# EAGLE design MegaPlay (EAGLE 7.2.0)
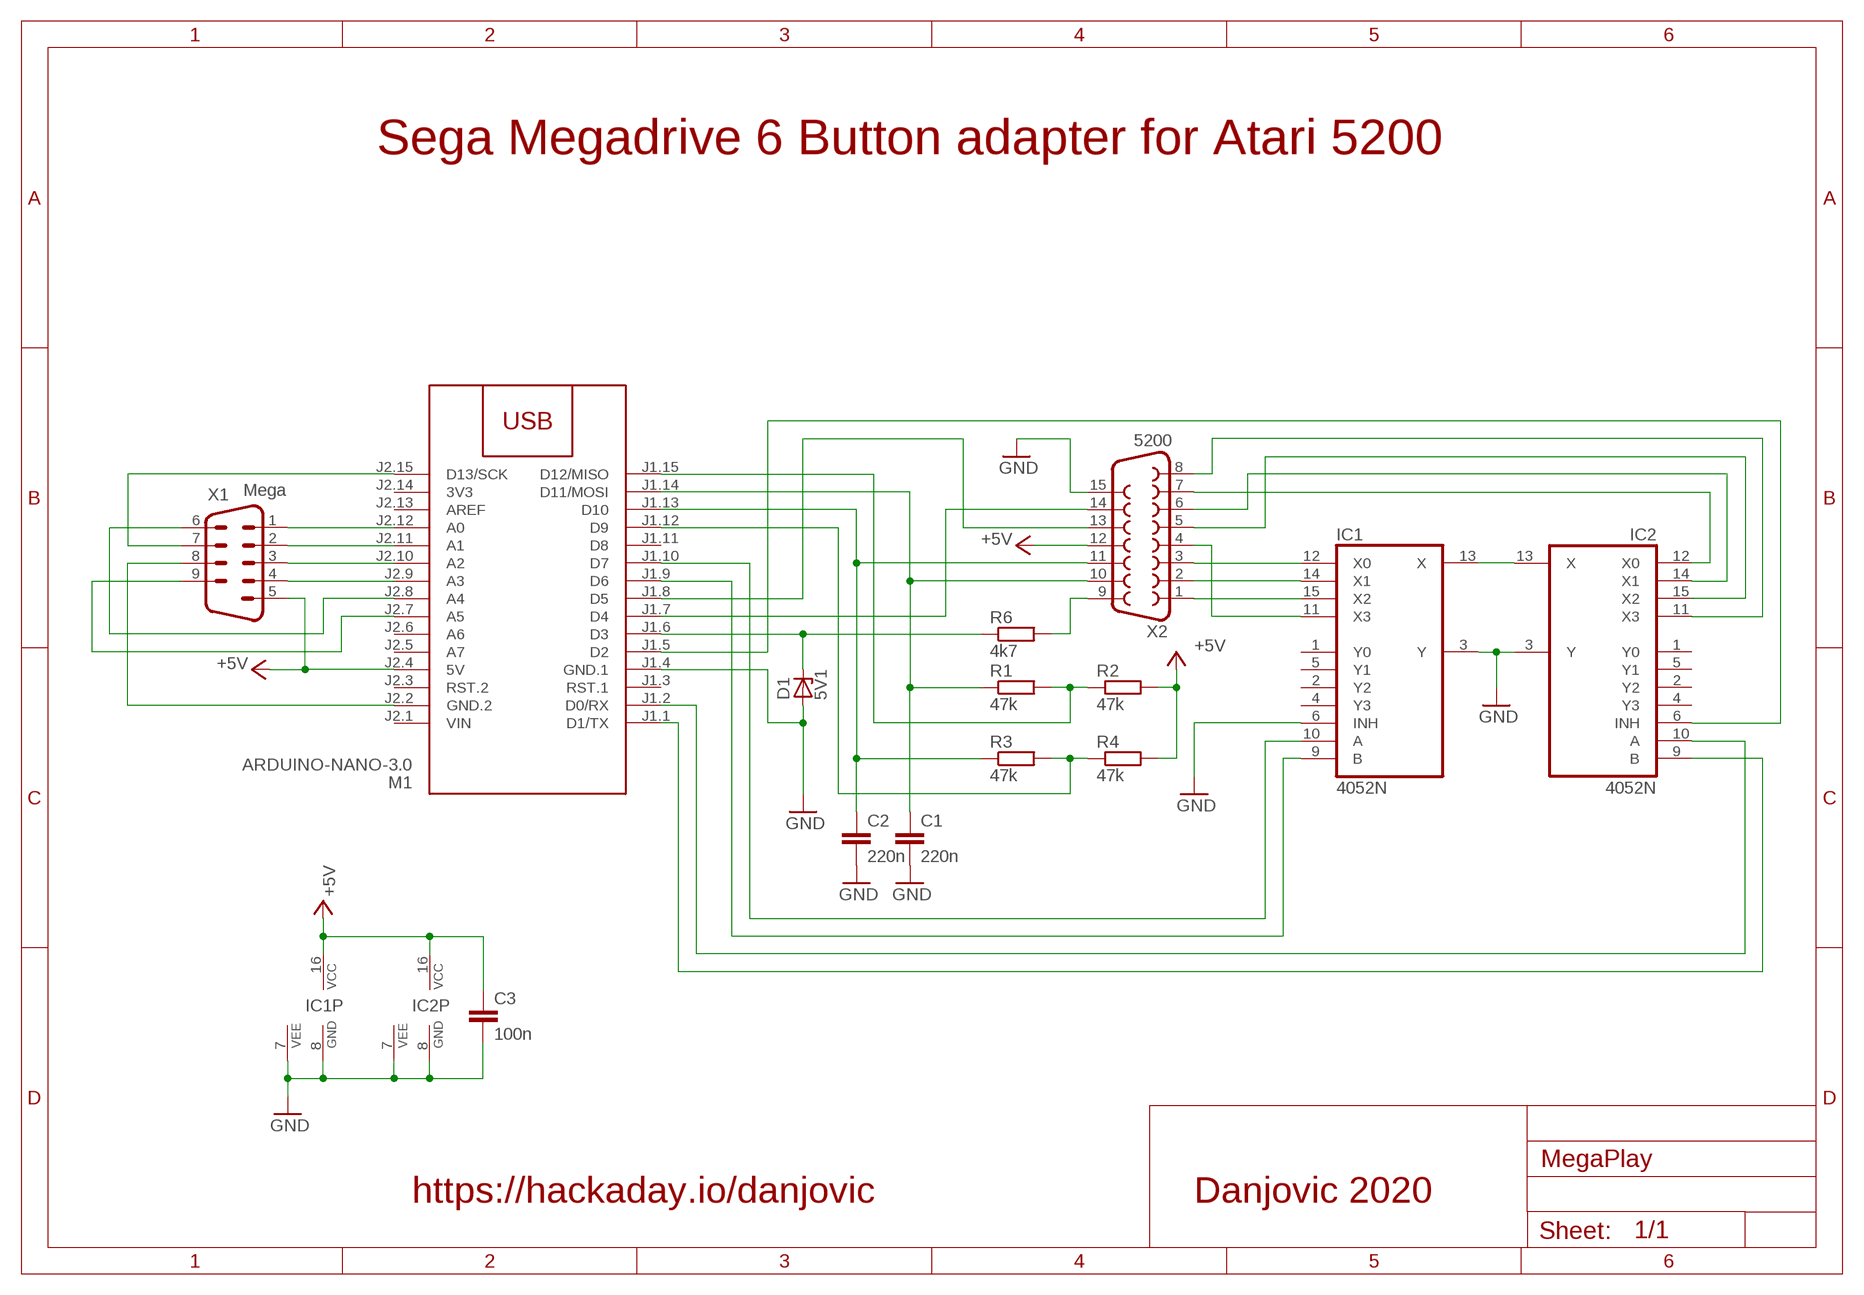
[diagram p0: schematic, sheet 1]

## Parts
C1  220n  C-EU050-025X075  [C050-025X075]
C2  220n  C-EU050-025X075  [C050-025X075]
C3  100n  C-EU050-024X044  [C050-024X044]
D1  5V1  ZENER-DIODEZD-7.5  [ZDIO-7.5]
IC1  4052N  [DIL16]
IC2  4052N  [DIL16]
M1  ARDUINO-NANO-3.0  [ARDUINO-NANO-3.0]
R1  47k  R-EU_0204/7  [0204/7]
R2  47k  R-EU_0204/7  [0204/7]
R3  47k  R-EU_0204/7  [0204/7]
R4  47k  R-EU_0204/7  [0204/7]
R6  4k7  R-EU_0204/7  [0204/7]
X1  Mega  M09D  [M09D]
X2  5200  F15D  [F15D]

## Nets
+5V: C3.1 IC1.16(VCC) IC2.16(VCC) M1.J2.4(5V) R2.2 R4.2 X1.5 X2.12
GND: C1.2 C2.2 C3.2 D1.A IC1.3(Y) IC1.6(INH) IC1.7(VEE) IC1.8(GND) IC2.3(Y) IC2.7(VEE) IC2.8(GND) M1.J1.4(GND.1) X2.15
N$1: M1.J1.12(D9) R3.2 R4.1
N$2: IC1.15(X2) X2.1
N$3: IC1.13(X) IC2.13(X)
N$4: IC1.14(X1) X2.2
N$5: IC1.12(X0) X2.3
N$6: IC1.11(X3) X2.4
N$7: IC2.15(X2) X2.5
N$8: IC2.14(X1) X2.6
N$9: IC2.12(X0) X2.7
N$10: M1.J2.12(A0) X1.1
N$11: C1.1 M1.J1.14(D11/MOSI) R1.1 X2.10
N$12: M1.J1.15(D12/MISO) R1.2 R2.1
N$13: IC2.11(X3) X2.8
N$14: C2.1 M1.J1.13(D10) R3.1 X2.11
N$15: M1.J1.8(D5) X2.13
N$16: M1.J2.11(A1) X1.2
N$17: M1.J2.10(A2) X1.3
N$18: M1.J2.9(A3) X1.4
N$19: M1.J2.15(D13/SCK) X1.7
N$20: M1.J2.8(A4) X1.6
N$21: M1.J2.7(A5) X1.9
N$22: M1.J2.2(GND.2) X1.8
N$23: D1.C M1.J1.6(D3) R6.1
N$24: IC2.6(INH) M1.J1.5(D2)
N$25: R6.2 X2.9
N$26: IC2.10(A) M1.J1.2(D0/RX)
N$27: IC2.9(B) M1.J1.1(D1/TX)
N$28: M1.J1.7(D4) X2.14
N$29: IC1.10(A) M1.J1.10(D7)
N$30: IC1.9(B) M1.J1.9(D6)
Unconnected: IC1.1(Y0) IC1.2(Y2) IC1.4(Y3) IC1.5(Y1) IC2.1(Y0) IC2.2(Y2) IC2.4(Y3) IC2.5(Y1) M1.J1.3(RST.1) M1.J1.11(D8) M1.J2.3(RST.2) M1.J2.5(A7) M1.J2.6(A6) M1.J2.13(AREF)

## Notes on the sheet
- Sega Megadrive 6 Button adapter for Atari 5200
- https://hackaday.io/danjovic | Danjovic 2020

## Power pins joined to a net without a drawn wire
3V3: M1.J2.14(3V3)
VIN: M1.J2.1(VIN)

## Library data of the parts
C1-C3 = rcl:C-EU: CAPACITOR, European symbol
D1 = diode:ZENER-DIODE: Z-Diode
IC1 IC2 = 40xx:4052: Dual 4-channel ANALOG MULTIPLEXER
M1 = diy-modules:ARDUINO-NANO-3.0: Arduino Nano 3.0 and compatible devices More details available here: https://www.arduino.cc/en/Main/ArduinoBoardNano Click here to find device on ebay.com <http://www.ebay.com/sch/arduino+nano>
R1-R4 R6 = rcl:R-EU_: RESISTOR, European symbol
X1 = con-subd:M09: SUB-D; OC_FARNELL: unknown; OC_NEWARK: unknown
X2 = con-subd:F15: SUB-D; OC_FARNELL: unknown; OC_NEWARK: unknown

## Board
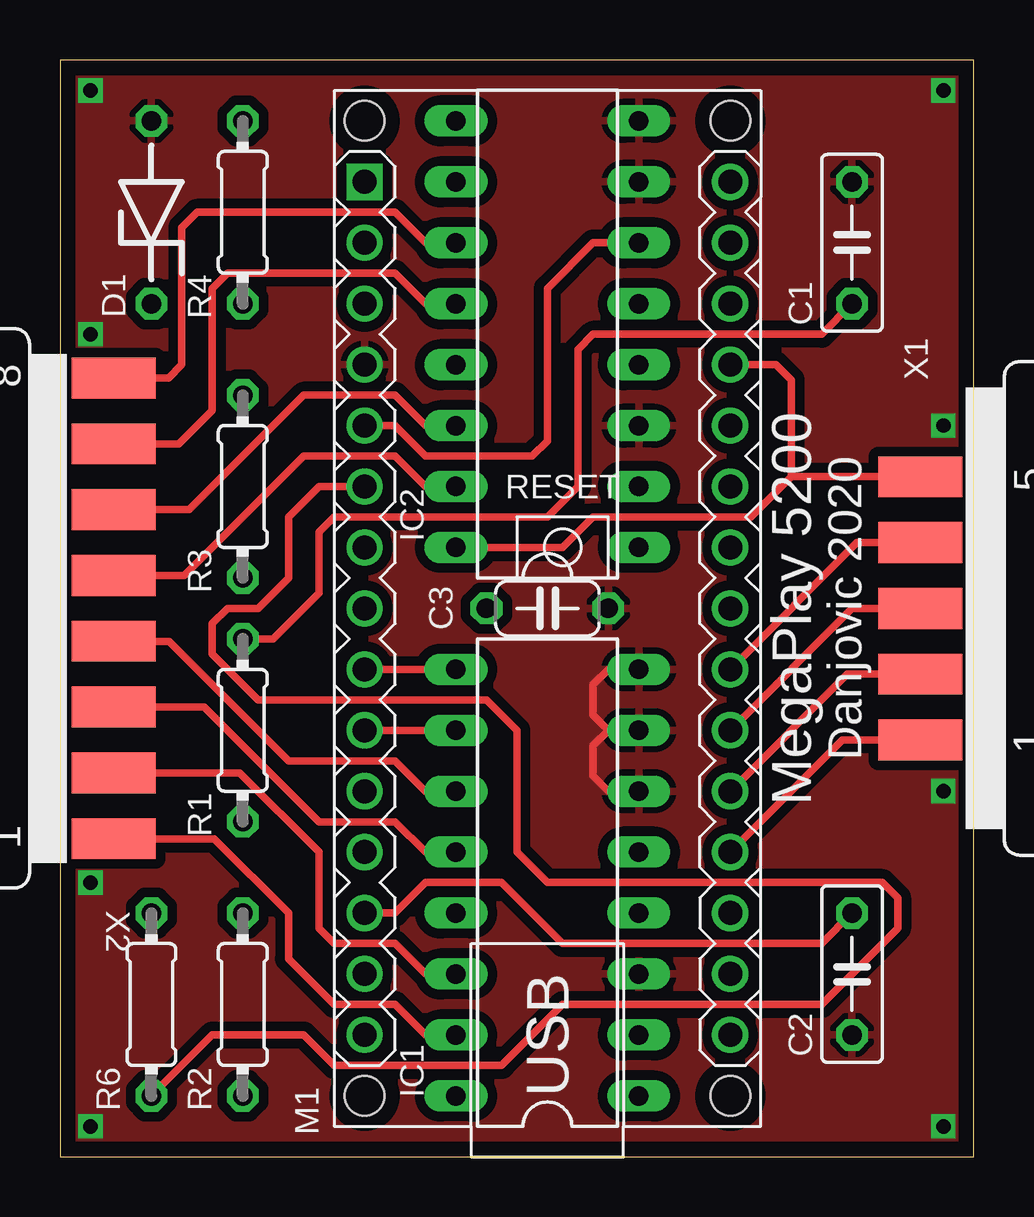
[diagram p1: board, top side]
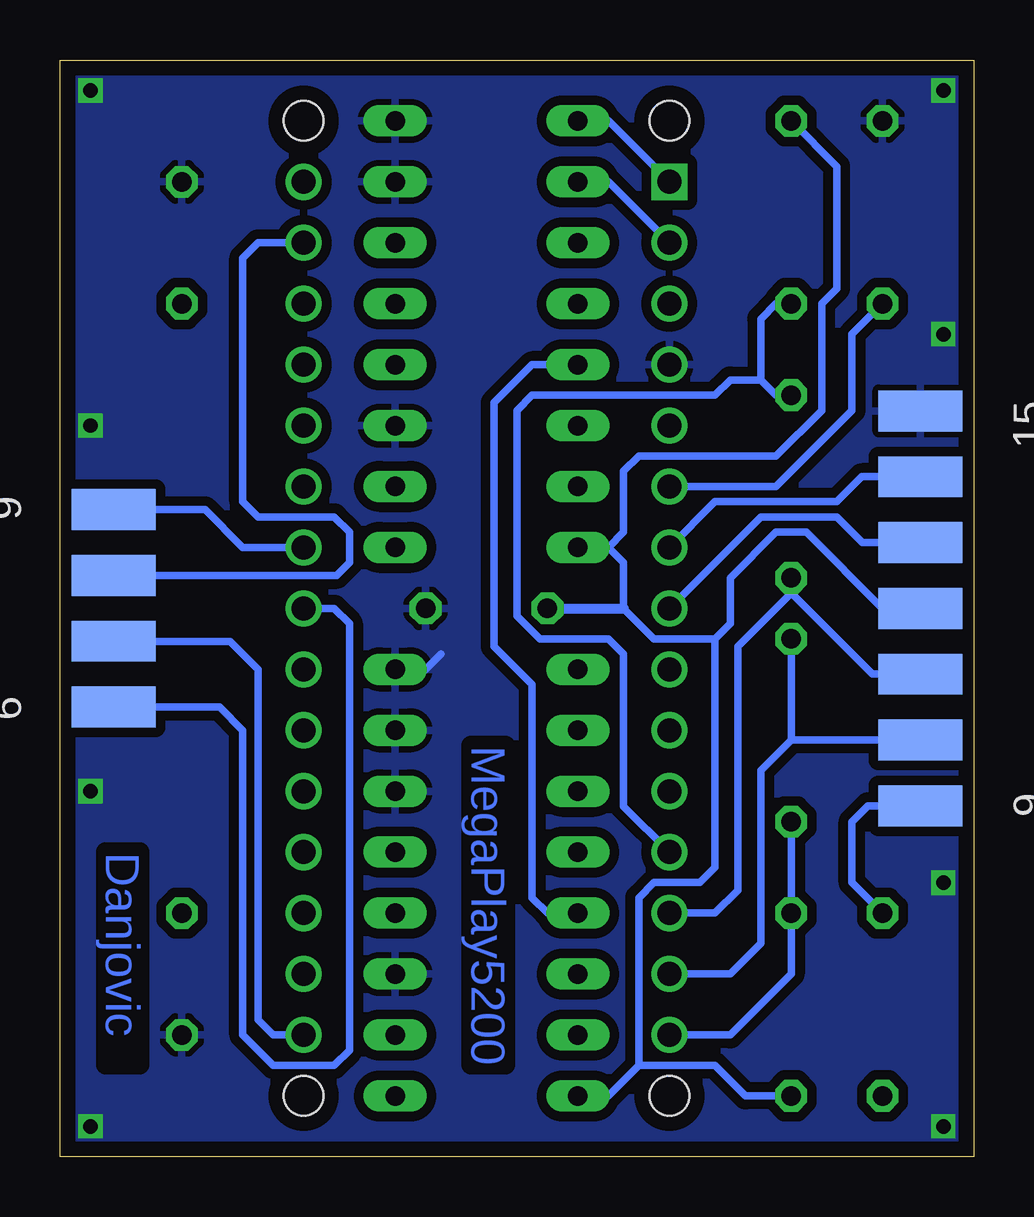
[diagram p2: board, bottom side, seen from below]

Size 38.1 x 45.72 mm. Coordinates in mm from the lower left corner, seen from the top.
Outline: 0,0 38.1,0 38.1,45.72 0,45.72 0,0
Copper layers (1*16): Top 0.035mm / dielectric 1.5mm / Bottom 0.035mm
Design rules "default *": minimum track width 10mil, minimum drill 24mil, track to track 8mil, track to pad 8mil, pad to pad 8mil, via to via 8mil, smd to smd 8mil, copper to edge 25mil, drill to drill 8mil, minimum pad ring 10mil, minimum via ring 8mil, stop-mask expansion 4mil, vias tented up to drill 0mil, thermal gap 10mil

### Footprints (pad centres in the part's own frame; a part is rotated, then mirrored left to right if it is on the bottom)
C050-025X075 = drill 0.813 octagon: 1 -2.54,0; 2 2.54,0
C050-024X044 = drill 0.813 octagon: 1 -2.54,0; 2 2.54,0
ZDIO-7.5 = drill 0.813 octagon: A 3.81,0; C -3.81,0
DIL16 = drill 0.813 long: 1 -8.89,-3.81; 2 -6.35,-3.81; 3 -3.81,-3.81; 4 -1.27,-3.81; 5 1.27,-3.81; 6 3.81,-3.81; 7 6.35,-3.81; 8 8.89,-3.81; 9 8.89,3.81; 10 6.35,3.81; 11 3.81,3.81; 12 1.27,3.81; 13 -1.27,3.81; 14 -3.81,3.81; 15 -6.35,3.81; 16 -8.89,3.81
ARDUINO-NANO-3.0 = drill 1 square: J1.1 17.78,7.62 | drill 1: J1.2 15.24,7.62; J1.3 12.7,7.62; J1.4 10.16,7.62; J1.5 7.62,7.62; J1.6 5.08,7.62; J1.7 2.54,7.62; J1.8 0,7.62; J1.9 -2.54,7.62; J1.10 -5.08,7.62; J1.11 -7.62,7.62; J1.12 -10.16,7.62; J1.13 -12.7,7.62; J1.14 -15.24,7.62; J1.15 -17.78,7.62; J2.1 17.78,-7.62; J2.2 15.24,-7.62; J2.3 12.7,-7.62; J2.4 10.16,-7.62; J2.5 7.62,-7.62; J2.6 5.08,-7.62; J2.7 2.54,-7.62; J2.8 0,-7.62; J2.9 -2.54,-7.62; J2.10 -5.08,-7.62; J2.11 -7.62,-7.62; J2.12 -10.16,-7.62; J2.13 -12.7,-7.62; J2.14 -15.24,-7.62; J2.15 -17.78,-7.62 | hole 1.651: -20.32,7.62; -20.32,-7.62; 20.32,-7.62; 20.32,7.62
0204/7 = drill 0.813 octagon: 1 -3.81,0; 2 3.81,0
M09D = smd 1.7 x 3.5: 1 5.486,-6.045; 2 2.743,-6.045; 3 0,-6.045; 4 -2.743,-6.045; 5 -5.486,-6.045 | smd 1.7 x 3.5 bottom: 6 4.115,-6.045; 7 1.372,-6.045; 8 -1.372,-6.045; 9 -4.115,-6.045
F15D = smd 1.7 x 3.5: 1 -9.601,-6.045; 2 -6.858,-6.045; 3 -4.115,-6.045; 4 -1.372,-6.045; 5 1.372,-6.045; 6 4.115,-6.045; 7 6.858,-6.045; 8 9.601,-6.045 | smd 1.7 x 3.5 bottom: 9 -8.23,-6.045; 10 -5.486,-6.045; 11 -2.743,-6.045; 12 0,-6.045; 13 2.743,-6.045; 14 5.486,-6.045; 15 8.23,-6.045

### Placement (x,y rotation side)
C1  33.02,38.1 90 top
C2  33.02,7.62 270 top
C3  20.32,22.86 0 top
D1  3.81,39.37 90 top
IC1  20.32,11.43 90 top
IC2  20.32,34.29 90 top
M1  20.32,22.86 90 top
R1  7.62,17.78 270 top
R2  7.62,6.35 270 top
R3  7.62,27.94 90 top
R4  7.62,39.37 90 top
R6  3.81,6.35 90 top
X1  41.91,22.86 270 top
X2  -3.81,22.86 90 top

### Tracks (layer width: path | path; a pad name or v marks a point on that pad's centre or on a via)
+5V
  Top 0.305: M1.J2.4 29.84,33.02 30.48,32.38 30.48,28.35 | IC2.16 20.95,25.4 22.23,26.67 28.8,26.67 30.48,28.35 | X1.5 30.48,28.35
  Bottom 0.305: X2.12 3.81,22.86 6.99,26.04 8.26,26.04 10.16,24.13 10.16,22.23 10.79,21.59 | 10.79,21.59 13.34,21.59 14.61,22.86 14.61,24.77 15.24,25.4 | R4.2 5.71,41.27 5.71,36.2 6.35,35.56 6.35,31.11 8.26,29.21 13.97,29.21 14.61,28.57 14.61,26.04 15.24,25.4 | R2.2 9.53,2.54 10.79,3.81 13.97,3.81 | 13.97,3.81 15.24,2.54 IC1.16 | 13.97,3.81 13.97,10.79 13.34,11.43 11.43,11.43 10.79,12.06 10.79,21.59 | IC2.16 15.24,25.4
  Bottom 0.406: C3.1 14.61,22.86
GND  (via drill 0.6)
  Top 0.305: 22.86,17.78 22.23,18.41 22.23,19.68 22.86,20.32 IC1.8 | IC1.6 22.86,15.24 22.23,15.88 22.23,17.14 22.86,17.78 | 22.86,17.78 IC1.7
  Bottom 0.305: 22.23,20.95 22.86,20.32 IC1.8
  other vias: 1.27,44.45 36.83,44.45 36.83,1.27 36.83,15.24 36.83,30.48 1.27,11.43 1.27,1.27 1.27,34.29
  pour Bottom (isolate 0.406): 0,0 0,45.72 38.1,45.72 38.1,0
  pour Top (isolate 0.406): 0,0 0,45.72 38.1,45.72 38.1,0
N$1
  Bottom 0.305: R4.1 8.26,35.56 8.89,34.92 8.89,32.38 | 8.89,32.38 10.16,32.38 10.79,31.75 18.41,31.75 19.05,31.11 19.05,22.54 18.1,21.59 15.24,21.59 14.61,20.95 14.61,14.61 M1.J1.12 | 8.89,32.38 8.26,31.75 R3.2
N$2
  Top 0.305: IC1.15 15.24,5.08 13.97,6.35 11.43,6.35 9.53,8.26 9.53,10.16 6.43,13.26 3.25,13.26
  Top 0.406: X2.1 3.25,13.26
N$3
  Bottom 0.305: IC2.13 18.41,33.02 20,31.43 20,21.27 18.41,19.68 18.41,10.79 17.78,10.16 IC1.13
N$4
  Top 0.305: IC1.14 15.24,7.62 13.97,8.89 11.43,8.89 10.79,9.53 10.79,12.7 7.49,16 X2.2
N$5
  Top 0.305: IC1.12 15.24,12.7 13.97,13.97 10.79,13.97 6.02,18.75 X2.3
N$6
  Top 0.305: IC1.11 15.24,15.24 13.97,16.51 9.53,16.51 4.55,21.49 X2.4
N$7
  Top 0.305: X2.5 5.18,24.23 10.16,29.21 13.97,29.21 15.24,27.94 IC2.15
N$8
  Top 0.305: IC2.14 15.24,30.48 13.97,31.75 10.16,31.75 5.38,26.98 X2.6
N$9
  Top 0.305: IC2.12 15.24,35.56 13.97,36.83 6.99,36.83 6.35,36.2 6.35,31.11 4.95,29.72 X2.7
N$10
  Top 0.305: X1.1 32.61,17.37 M1.J2.12
N$11
  Top 0.305: C1.1 31.75,34.29 22.23,34.29 21.59,33.66 21.59,27.94 20.32,26.67 11.43,26.67 10.79,26.04 10.79,23.5 8.89,21.59 R1.1
  Bottom 0.305: M1.J1.14 10.16,7.62 8.89,8.89 8.89,16.1 7.62,17.37 | X2.10 7.62,17.37 | 7.62,17.37 R1.1
N$12
  Bottom 0.305: R1.2 R2.1 7.62,7.62 10.16,5.08 M1.J1.15
N$13
  Top 0.305: IC2.11 15.24,38.1 13.97,39.37 5.71,39.37 5.08,38.73 5.08,33.02 4.52,32.46 X2.8
N$14
  Top 0.305: M1.J1.13 13.97,10.16 15.24,11.43 18.41,11.43 20.95,8.89 31.75,8.89 C2.1
  Bottom 0.305: 7.62,23.5 4.24,20.12 X2.11 | M1.J1.13 10.79,10.16 9.84,11.11 9.84,21.27 7.62,23.5 | 7.62,23.5 R3.1
N$15
  Bottom 0.305: X2.13 4.65,25.6 5.71,26.67 8.89,26.67 M1.J1.8
N$16
  Top 0.305: X1.2 32.82,20.12 M1.J2.11
N$17
  Top 0.305: X1.3 33.02,22.86 M1.J2.10
N$18
  Top 0.305: X1.4 33.22,25.6 M1.J2.9
N$19
  Bottom 0.305: X1.7 31.01,21.49 29.84,20.32 29.84,5.71 29.21,5.08 M1.J2.15
N$20
  Bottom 0.305: M1.J2.8 26.67,22.86 26.04,22.23 26.04,4.45 26.67,3.81 29.21,3.81 30.48,5.08 30.48,17.78 31.45,18.75 X1.6
N$21
  Bottom 0.305: X1.9 32.05,26.98 30.48,25.4 M1.J2.7
N$22
  Bottom 0.305: X1.8 26.57,24.23 26.04,24.77 26.04,26.04 26.67,26.67 29.84,26.67 30.48,27.3 30.48,37.47 29.84,38.1 M1.J2.2
N$23
  Top 0.305: R6.1 6.35,5.08 10.16,5.08 11.43,3.81 18.41,3.81 20.95,6.35 31.75,6.35 34.92,9.53 34.92,10.79 34.29,11.43 20.32,11.43 19.05,12.7 19.05,17.78 17.78,19.05 8.26,19.05 6.35,20.95 6.35,22.23 6.99,22.86 8.26,22.86 9.53,24.13 9.53,26.67 10.79,27.94 M1.J1.6
  Bottom 0.305: D1.C 5.08,34.29 5.08,31.11 8.26,27.94 M1.J1.6
N$24
  Top 0.305: M1.J1.5 13.97,30.48 15.24,29.21 19.68,29.21 20.32,29.84 20.32,36.2 22.23,38.1 IC2.6
N$25
  Bottom 0.305: R6.2 5.08,11.43 5.08,13.97 4.42,14.63 X2.9
N$26
  Bottom 0.305: M1.J1.2 15.24,40.64 IC2.10
N$27
  Bottom 0.305: M1.J1.1 15.24,43.18 IC2.9
N$28
  Bottom 0.305: X2.14 4.67,28.35 5.71,27.3 10.79,27.3 M1.J1.7
N$29
  Top 0.305: M1.J1.10 IC1.10
N$30
  Top 0.305: M1.J1.9 IC1.9

### Text on the board
Bottom: MegaPlay5200 | Danjovic
tPlace: MegaPlay 5200 | Danjovic 2020